# EAGLE design untitled (EAGLE 8.2.1)
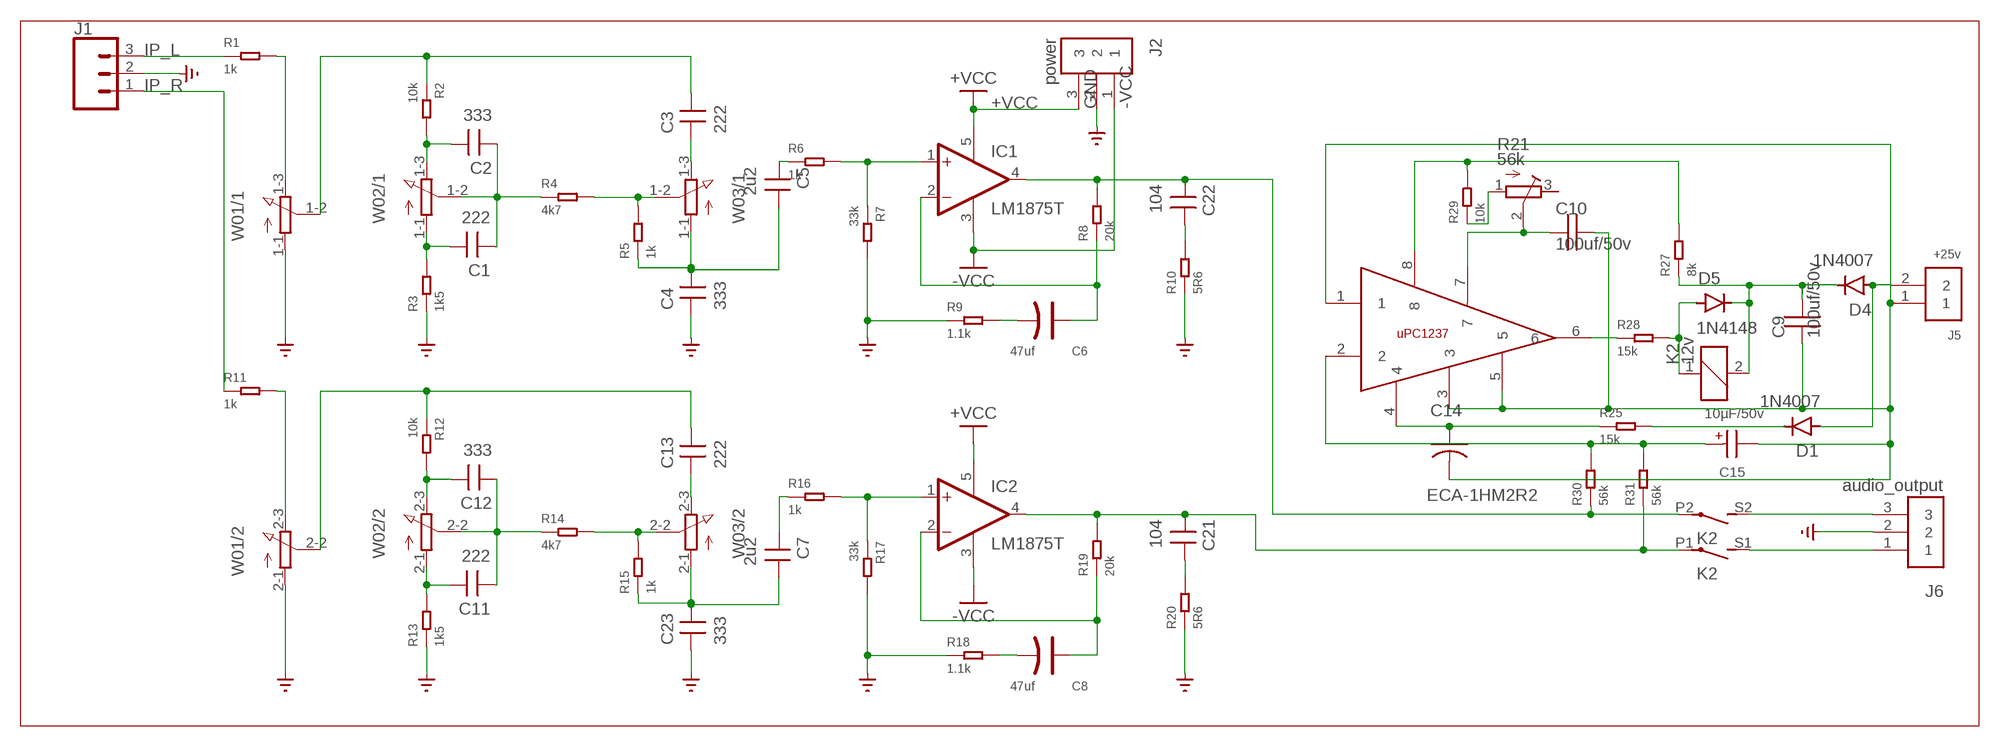
[diagram p0: schematic, sheet 1]

## Parts
C1  222  5.08MM-  [5.08MM-独石电容]
C2  333  5.08MM-  [5.08MM-独石电容]
C3  222  5.08MM-  [5.08MM-独石电容]
C4  333  5.08MM-  [5.08MM-独石电容]
C5  2u2  5.08MM-  [5.08MM-独石电容]
C6  47uf  DIP-ALUMINUM-47UF-16V(D5-H7MM)  [PC-D5.3MM]
C7  2u2  5.08MM-  [5.08MM-独石电容]
C8  47uf  DIP-ALUMINUM-47UF-16V(D5-H7MM)  [PC-D5.3MM]
C9  100uf/50v  50V100UF8X12  [8X12]
C10  100uf/50v  50V100UF8X12  [8X12]
C11  222  5.08MM-  [5.08MM-独石电容]
C12  333  5.08MM-  [5.08MM-独石电容]
C13  222  5.08MM-  [5.08MM-独石电容]
C14  ECA-1HM2R2  [CAP_RADIAL_2MM]
C15  10µF/50v  WCAP-AT1H_5X11_860240272001  [WCAP-AT1H_5X11(DXL)]
C21  104  5.08MM-  [5.08MM-独石电容]
C22  104  5.08MM-  [5.08MM-独石电容]
C23  333  5.08MM-  [5.08MM-独石电容]
D1  1N4007  [DO-41]
D4  1N4007  [DO-41]
D5  1N4148  1N4007  [DO-41]
IC1  LM1875T  [CB367]
IC2  LM1875T  [CB367]
J1  CONN_03POLAR  [MOLEX-1X3]
J2  power  691311400103  [TERMINALBLOCK_PLUGGABLE-3-7.62MM]
J5  +25v  61300211121  [61300211121]
J6  audio_output  691311400103  [TERMINALBLOCK_PLUGGABLE-3-7.62MM]
K2  12v  G2R2A  [G2R2A]
R1  1k  DIP-RES-1M-5%-1/4W(PR-D2.3XL6.5MM)  [PR-D2.3XL6.5MM]
R2  10k  DIP-RES-1M-5%-1/4W(PR-D2.3XL6.5MM)  [PR-D2.3XL6.5MM]
R3  1k5  DIP-RES-1M-5%-1/4W(PR-D2.3XL6.5MM)  [PR-D2.3XL6.5MM]
R4  4k7  DIP-RES-1M-5%-1/4W(PR-D2.3XL6.5MM)  [PR-D2.3XL6.5MM]
R5  1k  DIP-RES-1M-5%-1/4W(PR-D2.3XL6.5MM)  [PR-D2.3XL6.5MM]
R6  1k  DIP-RES-1M-5%-1/4W(PR-D2.3XL6.5MM)  [PR-D2.3XL6.5MM]
R7  33k  DIP-RES-1M-5%-1/4W(PR-D2.3XL6.5MM)  [PR-D2.3XL6.5MM]
R8  20k  DIP-RES-1M-5%-1/4W(PR-D2.3XL6.5MM)  [PR-D2.3XL6.5MM]
R9  1.1k  DIP-RES-1M-5%-1/4W(PR-D2.3XL6.5MM)  [PR-D2.3XL6.5MM]
R10  5R6  DIP-RES-1M-5%-1/4W(PR-D2.3XL6.5MM)  [PR-D2.3XL6.5MM]
R11  1k  DIP-RES-1M-5%-1/4W(PR-D2.3XL6.5MM)  [PR-D2.3XL6.5MM]
R12  10k  DIP-RES-1M-5%-1/4W(PR-D2.3XL6.5MM)  [PR-D2.3XL6.5MM]
R13  1k5  DIP-RES-1M-5%-1/4W(PR-D2.3XL6.5MM)  [PR-D2.3XL6.5MM]
R14  4k7  DIP-RES-1M-5%-1/4W(PR-D2.3XL6.5MM)  [PR-D2.3XL6.5MM]
R15  1k  DIP-RES-1M-5%-1/4W(PR-D2.3XL6.5MM)  [PR-D2.3XL6.5MM]
R16  1k  DIP-RES-1M-5%-1/4W(PR-D2.3XL6.5MM)  [PR-D2.3XL6.5MM]
R17  33k  DIP-RES-1M-5%-1/4W(PR-D2.3XL6.5MM)  [PR-D2.3XL6.5MM]
R18  1.1k  DIP-RES-1M-5%-1/4W(PR-D2.3XL6.5MM)  [PR-D2.3XL6.5MM]
R19  20k  DIP-RES-1M-5%-1/4W(PR-D2.3XL6.5MM)  [PR-D2.3XL6.5MM]
R20  5R6  DIP-RES-1M-5%-1/4W(PR-D2.3XL6.5MM)  [PR-D2.3XL6.5MM]
R21  56k  R-TRIMM3296W  [RTRIM3296W]
R25  15k  DIP-RES-1M-5%-1/4W(PR-D2.3XL6.5MM)  [PR-D2.3XL6.5MM]
R27  8k  DIP-RES-1M-5%-1/4W(PR-D2.3XL6.5MM)  [PR-D2.3XL6.5MM]
R28  15k  DIP-RES-1M-5%-1/4W(PR-D2.3XL6.5MM)  [PR-D2.3XL6.5MM]
R29  10k  DIP-RES-1M-5%-1/4W(PR-D2.3XL6.5MM)  [PR-D2.3XL6.5MM]
R30  56k  DIP-RES-1M-5%-1/4W(PR-D2.3XL6.5MM)  [PR-D2.3XL6.5MM]
R31  56k  DIP-RES-1M-5%-1/4W(PR-D2.3XL6.5MM)  [PR-D2.3XL6.5MM]
U2  UPC1237HA  [SIP8]
W01  3RP/1610G  [3RP/1610G]
W02  3RP/1610G  [3RP/1610G]
W03  3RP/1610G  [3RP/1610G]

## Nets
+VCC: IC1.5(V+) IC2.5(V+) J2.3
-VCC: IC1.3(V-) IC2.3(V-) J2.1
GND: C4.P$2 C23.P$2 J1.2 J2.2 J6.2 R3.1 R7.2 R9.1 R10.1 R13.1 R17.2 R18.1 R20.1 W01.1-1(/1:A) W01.2-1(/2:A) ; supply symbol labelled SUPPLY0_GND_
IP_L: J1.3 R1.1
IP_R: J1.1 R11.1
N$1: R1.2 W01.1-3(/1:E)
N$2: C3.P$1 R2.1 W01.1-2(/1:S)
N$3: C2.P$1 R2.2 W02.1-3(/1:E)
N$4: C1.P$1 R3.2 W02.1-1(/1:A)
N$5: R4.2 R5.2 W03.1-2(/1:S)
N$6: C1.P$2 C2.P$2 R4.1 W02.1-2(/1:S)
N$7: IC1.1(+IN) R6.2 R7.1
N$8: C4.P$1 C5.P$1 R5.1 W03.1-1(/1:A)
N$9: C22.P$2 IC1.4(OUT) K2.P2(3:P) R8.2 R30.1
N$10: C6.+ IC1.2(-IN) R8.1
N$11: C5.P$2 R6.1
N$12: C6.- R9.2
N$13: C22.P$1 R10.2
N$14: C3.P$2 W03.1-3(/1:E)
N$15: R11.2 W01.2-3(/2:E)
N$16: C13.P$1 R12.1 W01.2-2(/2:S)
N$17: C12.P$1 R12.2 W02.2-3(/2:E)
N$18: C11.P$1 R13.2 W02.2-1(/2:A)
N$19: R14.2 R15.2 W03.2-2(/2:S)
N$20: C11.P$2 C12.P$2 R14.1 W02.2-2(/2:S)
N$21: C7.P$1 C23.P$1 R15.1 W03.2-1(/2:A)
N$22: IC2.1(+IN) R16.2 R17.1
N$23: C21.P$2 IC2.4(OUT) K2.P1(2:P) R19.2 R31.1
N$24: C8.+ IC2.2(-IN) R19.1
N$25: C7.P$2 R16.1
N$26: C8.- R18.2
N$27: C21.P$1 R20.2
N$28: C13.P$2 W03.2-3(/2:E)
N$29: J6.1 K2.S1(2:S)
N$30: J6.3 K2.S2(3:S)
N$31: D1.C R25.2
N$32: R21.1(A) R29.1
N$40: D1.A D4.A J5.2
N$41: R28.1 U2.6
N$42: D5.A K2.1 R28.2
N$43: C9.2 D4.C D5.C K2.2 R27.1
N$44: R27.2 R29.2 U2.8
N$45: C10.1 R21.2(S) U2.7
N$46: C9.1 C10.2 C14.2 C15.2(-) J5.1 U2.1 U2.3 U2.5
N$47: C14.1 R25.1 U2.4
N$48: C15.1(+) R30.2 R31.2 U2.2
Unconnected: R21.3(E)

## Library data of the parts
C1-C5 C7 C11-C13 C21-C23 = Audio-Power-amlifier:5.08MM-; LONG: 5.08mm
C6 C8 = OPL_Capacitor:DIP-ALUMINUM-47UF-16V(D5-H7MM): 302030033; MPN: KS 100uF/16V; VALUE: 100uf
C9 C10 = Audio-Power-amlifier:50V100UF8X12
C14 = Resistor_Capacitor:ECA-1HM2R2: CAP ALUM 2.2UF 20% 50V RADIAL Manufacturer's datasheet <https://media.digikey.com/pdf/Data%20Sheets/Panasonic%20Electronic%20Components/ECA-xxM%20Series,TypeA.pdf>; CREATED_BY: PCBLayout.com; DIGIKEY_PART_NUMBER: P5175-ND; MANUFACTURER: Panasonic Electronic Components; MPN: ECA-1HM2R2; PACKAGE: CAP RADIAL 2MM LS
C15 = Wurth_Capacitors_WCAP-AT1H:WCAP-AT1H_5X11: WCAP-AT1H Aluminium Electrolytic Capacitors Long Life +105 °C Characteristics Long life product series Mounting style: THT Radial Capacitance range: 6.8 µF ‒ 3300 µF Capacitance tolerance: ±20 % Voltage range (UR): 10 ‒ 450 V(DC) Operating temperature: -40 °C up to +105 °C for UR ≤100 V(DC) -25 °C up to +105 °C for UR > 100 V(DC) Endurance: 5000 ‒ 10000 h @ +105 °C Dimensions (DxL) in mm: 5.0 x 11.0 up to 18.0 x 35.5 Recommended soldering: Wave soldering Applications Long life applications (industry, medical) Filtering Smoothing Energy storage Coupling e.g. Switched-mode power supply, AC/DC converter, adapter, charger, digital camera <https://www.we-online.com/catalog/media/o14727v209%20Family_WCAP-AT1H.jpg> Details see: https://www.we-online.com/catalog/en/WCAP-AT1H/ Updated by yingchun,Shan;2020-02-28 2020(C) Würth Elektronik; DATASHEET-URL: https://www.we-online.com/catalog/datasheet/860240272001.pdf; DF: 19%; DIAMETER: 5mm; I-LEAK: 4.7uA; I-RIPPLE: 100mA; L: 11mm; OPERATING-TEMPERATURE: -40 °C up to +105 °C; PART-NUMBER: 860240272001; PITCH: 2mm; TECHNICAL-REFERENCE: ATDC110470M010DSPA3E000; VALUE: 47 µF; VR: 10V(DC)
D1 D4 D5 = Diodes:1N4007: DIODE GEN PURP 1KV 1A DO41 Manufacturer's datasheet <https://www.mccsemi.com/pdf/Products/1N4001-1N4007(DO-41).pdf>; CREATED_BY: PCBLayout.com; DIGIKEY_PART_NUMBER: 1N4007MSCT-ND; MANUFACTURER: Micro Commercial Co; MPN: 1N4007; PACKAGE: DO-41
IC1 IC2 = linear:LM1875T: Power OP AMP
J1 = SparkFun-Connectors:CONN_03: Multi connection point. Often used as Generic Header-pin footprint for 0.1 inch spaced/style header connections On any of the 0.1 inch spaced packages, you can populate with these: Break Away Headers - Straight <https://www.sparkfun.com/products/116> (PRT-00116) Break Away Male Headers - Right Angle <https://www.sparkfun.com/products/553> (PRT-00553) Female Headers <https://www.sparkfun.com/products/115> (PRT-00115) Break Away Headers - Machine Pin <https://www.sparkfun.com/products/117> (PRT-00117) Break Away Female Headers - Swiss Machine Pin <https://www.sparkfun.com/products/743> (PRT-00743) Stackable Header - 3 Pin (Female, 0.1") <https://www.sparkfun.com/products/13875> (PRT-13875) For SCREWTERMINALS and SPRING TERMINALS visit here: Screw Terimnals on SparkFun.com <https://www.sparkfun.com/search/results?term=Screw+Terminals> (5mm/3.5mm/2.54mm spacing) This device is also useful as a general connection point to wire up your design to another part of your project. Our various solder wires solder well into these plated through hole pads. Hook-Up Wire - Assortment (Stranded, 22 AWG) <https://www.sparkfun.com/products/11375> (PRT-11375) Hook-Up Wire - Assortment (Solid Core, 22 AWG) <https://www.sparkfun.com/products/11367> (PRT-11367) View the entire wire category on our website here <https://www.sparkfun.com/categories/141> Special notes: Molex polarized connector foot print use with SKU : PRT-08232 with associated crimp pins and housings.; PROD_ID: CONN-08625; SF_ID: PRT-08096
J2 J6 = Terminal Blocks:691311400103: 7.62MM CLOSE VERTICAL PCB HEADER WR-TBL Manufacturer's datasheet <https://katalog.we-online.com/em/datasheet/6913114001xx.pdf>; CREATED_BY: PCBLayout.com; DIGIKEY_PART_NO: 732-2824-ND; MANUFACTURER: WURTH ELEKTRONIK; MPN: 691311400103
J5 = Headers:61300211121: CONN HEADER VERT 2POS 2.54MM Manufacturer's datasheet <https://katalog.we-online.de/em/datasheet/6130xx11121.pdf>; CREATED_BY: PCBLayout.com; DIGI_KEY_PART_NUMBER: 732-5315-ND; MANUFACTURER: Wurth Electronics Inc.; MPN: 61300211121
K2 = relay:G2R2A: RELAY 2 x norm. open, Omron; MPN: G2R-2A-DC24; OC_FARNELL: 6985269; OC_NEWARK: 36M5257
R1-R20 R25 R27-R31 = OPL_Resistor:DIP-RES-1M-5%-1/4W(PR-D2.3XL6.5MM): 301020005; MPN: FHCFR-1/4W-105J; VALUE: 1M
R21 = rcl:R-TRIMM: Trimm resistor; SPICEMODEL: X; SPICEPREFIXL: POT
U2 = Audio-Power-amlifier:UPC1237HA
W01-W03 = pot:3RP/1610G: 16mm Potentiometer two level Source: http://www.alphapotentiometers.net/html/16mm_pot_2.html

## Board
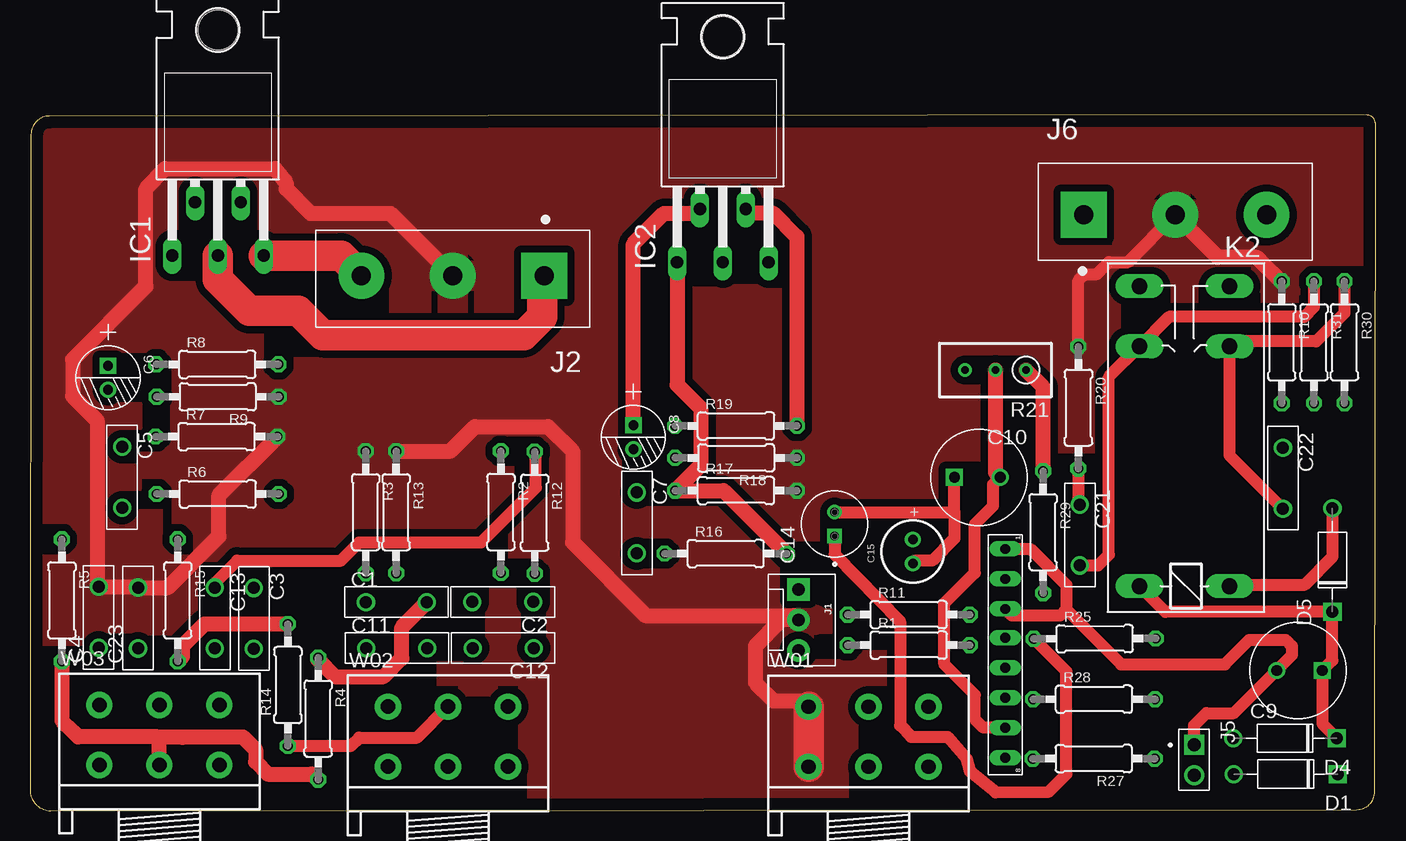
[diagram p1: board, top side]
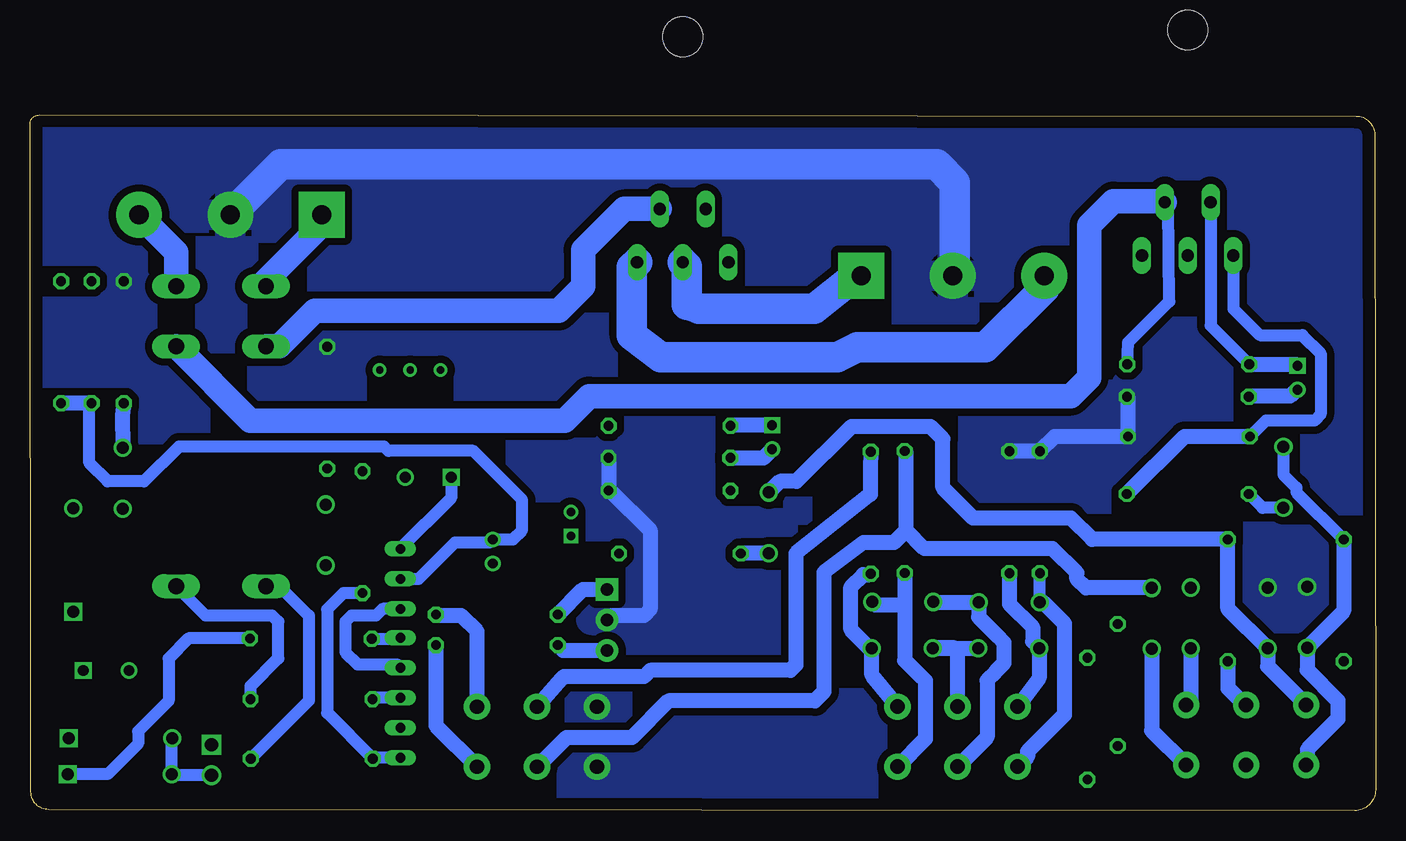
[diagram p2: board, bottom side, seen from below]

Size 112.13 x 57.97 mm. Coordinates in mm from the lower left corner, seen from the top.
Outline: 1.73,0 110.58,0.09 arc90 112.05,1.56 112.13,57.21 arc90 111.36,57.97 1.62,57.88 arc90 0.08,56.34 0,1.74 arc90 1.73,0
Copper layers (1*16): Top 0.035mm / dielectric 1.5mm / Bottom 0.035mm
Design rules "default": minimum track width 6mil, minimum drill 0.35mm, track to track 6mil, track to pad 6mil, pad to pad 6mil, via to via 6mil, smd to smd 6mil, copper to edge 40mil, drill to drill 6mil, minimum pad ring 10mil, minimum via ring 8mil, stop-mask expansion 4mil, vias tented up to drill 0mil, thermal gap 10mil

### Footprints (pad centres in the part's own frame; a part is rotated, then mirrored left to right if it is on the bottom)
5.08MM-独石电容 = drill 1: P$1 -2.54,0; P$2 2.54,0
PC-D5.3MM = drill 0.8 pad 1.35 square: + -1,0 | drill 0.8 pad 1.35: - 1,0
8X12 = drill 0.9: 1 -1.778,0 | drill 0.9 square: 2 2.032,0
CAP_RADIAL_2MM = drill 0.7 pad 1.1 square: 1 -1,0 | drill 0.7 pad 1.1: 2 1,0
WCAP-AT1H_5X11(DXL) = drill 0.8: 1 1,0; 2 -1,0
DO-41 = drill 1: A 4.325,0 | drill 1 square: C -4.325,0
CB367 = drill 1.016 long: 1 -3.81,-11.43; 2 -1.905,-6.985; 3 0,-11.43; 4 1.905,-6.985; 5 3.81,-11.43 | hole 3.302: 0,7.366
MOLEX-1X3 = drill 1.016 pad 1.88 square: 1 0,0 | drill 1.016 pad 1.88: 2 2.54,0; 3 5.08,0
TERMINALBLOCK_PLUGGABLE-3-7.62MM = drill 1.6 pad 3.81 square: 1 -7.62,0 | drill 1.6 pad 3.81: 2 0,0; 3 7.62,0
61300211121 = drill 1.1 square: 1 -1.27,0 | drill 1.1: 2 1.27,0
G2R2A = drill 1.321 long: 1 -2.54,-3.683; 2 -2.54,3.81; P1 17.45,3.81; P2 17.45,-3.683; S1 22.454,3.81; S2 22.454,-3.683
PR-D2.3XL6.5MM = drill 0.813 octagon: 1 -4.953,0; 2 5.207,0
RTRIM3296W = drill 0.61: 1 0,-2.54; 2 0,0; 3 0,2.54
SIP8 = drill 0.8 long: 1 -8.8,3.6; 2 -6.3,3.6; 3 -3.8,3.6; 4 -1.4,3.6; 5 1.1,3.6; 6 3.6,3.6; 7 6.1,3.6; 8 8.6,3.6
3RP/1610G = drill 1.2 pad 2.184: 1-1 -5,0; 1-2 0,0; 1-3 5,0; 2-1 -5,5; 2-2 0,5; 2-3 5,5

### Placement (x,y rotation side)
C1  30.54,17.37 0 top
C2  39.4,17.39 180 top
C3  18.65,16.02 270 top
C4  5.71,16.11 90 top
C5  7.67,27.78 270 top
C6  6.5,36.07 270 top
C7  50.56,23.98 270 top
C8  50.28,31.12 270 top
C9  105.66,11.69 0 top
C10  79.07,27.78 180 top
C11  30.57,13.55 0 top
C12  39.43,13.55 180 top
C13  15.4,16.06 270 top
C14  67.05,23.88 90 top
C15  73.57,21.6 90 top
C21  87.48,22.97 270 top
C22  104.42,27.71 270 top
C23  9,16.06 90 top
D1  104.65,3.05 180 top
D4  104.59,6.03 180 top
D5  108.54,20.89 90 top
IC1  15.66,57.69 0 top
IC2  57.73,57.13 0 top
J1  64.05,18.43 270 top
J2  35.23,44.58 180 top
J5  97.01,4.23 270 top
J6  95.43,49.65 0 top
K2  96.27,21.25 90 top
R1  73.1,13.8 0 top
R2  39.24,25.02 270 top
R3  27.97,25 270 top
R4  24.01,7.8 270 top
R5  2.66,17.65 270 top
R6  15.52,26.39 0 top
R7  15.42,31.18 0 top
R8  15.48,37.19 0 top
R9  15.77,34.49 180 top
R10  104.31,39.16 270 top
R11  73.1,16.34 0 top
R12  42.06,24.96 270 top
R13  30.51,25 270 top
R14  21.49,10.34 90 top
R15  12.31,17.65 270 top
R16  57.84,21.43 0 top
R17  58.71,26.68 0 top
R18  58.97,29.4 180 top
R19  58.71,32.07 0 top
R20  87.37,33.72 270 top
R21  80.45,36.72 90 top
R25  88.6,14.33 0.2 top
R27  88.77,4.34 180 top
R28  88.55,9.29 0 top
R29  84.42,23.34 270 top
R30  109.54,39.16 270 top
R31  107,39.16 270 top
U2  77.67,13.01 270 top
W01  69.88,3.66 0 top
W02  34.83,3.67 0 top
W03  10.78,3.81 0 top

### Tracks (layer width: path | path; a pad name or v marks a point on that pad's centre or on a via)
+VCC
  Top 2.54: IC1.5 25.93,46.26 J2.3
  Bottom 2.54: J2.3 27.61,43.5 32.51,38.61 43.18,38.61 44.85,37.78 59.58,37.78 61.97,39.63 61.97,45.27 IC2.5
-VCC
  Top 2.54: IC1.3 15.66,44.28 18.29,41.66 22.35,41.66 24.38,39.63 41.15,39.63 42.67,41.15 42.67,44.4 J2.1
  Bottom 2.54: J2.1 43.3,44.58 46.76,41.83 56.41,41.83 57.4,42.17 57.4,45.37 IC2.3
GND
  Top 1.016: R20.1 87.37,44.19 87.88,44.71 88.9,44.71 89.91,45.72 91.5,45.72 J6.2
  Top 1.27: W01.2-1 64.39,9.15 61.97,9.15 60.45,10.67 60.45,13.72 62.62,15.89 J1.2 63.68,16.26 51.31,16.26 45.21,22.35 45.21,29.97 43.18,32.01 37.08,32.01 35.03,29.96 R13.1 | J2.2 30.03,49.79 23.37,49.79 21.33,51.82 21.33,52.33 20.4,53.5 11.25,53.5 9.65,51.82 9.65,43.69 3.55,37.59 3.55,34.55 5.59,32.51 5.59,18.78 C4.P$2 8.94,18.65 C23.P$2 11.48,18.6 15.75,22.86 15.75,26.29 R7.2 | R10.1 104.22,44.11 102.61,45.72 102.61,45.73 102.23,46.11 98.97,46.11 J6.2
  Top 2.54: W01.2-1 W01.1-1
  Bottom 1.27: R18.1 63.91,29.39 R17.2 63.76,26.68 60.45,23.37 60.45,16.77 60.96,16.26 63.68,16.26 J1.2 | R9.1 20.63,34.4 R7.2 26.75,31.18 R3.1 R13.1
  Bottom 2.54: J2.2 35.05,44.77 35.05,52.33 36.57,53.85 91.23,53.85 J6.2
  pour Top (isolate 0.61): 1.01,57.91 0,55.37 0,1.02 1.01,0 111.11,0.12 112.12,1.14 112.12,55.49 111.11,58.03
  pour Bottom (isolate 0.61): 111.11,58.03 3.75,57.92 arc68 0,55.37 0,1.02 1.01,0 111.11,0.12 112.12,1.14 112.12,55.49
IP_L
  Bottom 1.27: R1.1 67.7,13.35 J1.3
IP_R
  Bottom 1.27: R11.1 66.05,18.43 J1.1
N$1
  Bottom 1.27: R1.2 78.3,7.09 W01.1-3
N$2
  Bottom 1.27: C3.P$1 24.14,18.56 24.89,19.31 24.89,19.81 26.92,21.85 37.59,21.85 39.11,23.37 | R2.1 39.11,29.84 39.11,23.37 | 39.11,23.37 40.13,22.35 42.67,22.35 45.97,19.87 45.97,9.91 46.73,9.15 58.93,9.15 61.97,6.1 67.44,6.1 W01.1-2
N$3
  Bottom 1.27: R2.2 39.24,17.13 | 39.24,17.13 39.24,12.52 37.82,11.1 37.77,11.1 37.51,10.84 37.51,5.99 W02.1-3 | 39.24,17.13 41.67,17.13 C2.P$1
N$4
  Bottom 1.016: 27.71,17.37 C1.P$1 28,19.77 R3.2
  Bottom 1.27: 27.71,17.37 25.94,15.6 25.94,7.98 28.99,4.94 28.99,4.51 W02.1-1
N$5
  Top 1.27: R5.2 2.66,7.5 3.55,6.61 3.55,6.6 4.01,6.15 10.67,6.15 | R4.2 23.97,2.54 23.46,3.05 19.81,3.05 18.79,4.07 18.79,5.08 17.73,6.15 12.66,6.15 | 10.67,6.15 12.66,6.15 | 12.66,6.15 12.7,6.11 | W03.1-2 10.78,6.03 10.67,6.15
N$6
  Top 1.27: R4.1 24.01,12.56 25.4,11.18 29.46,11.18 30.99,12.7 30.99,15.28 C1.P$2
  Bottom 1.27: C2.P$2 36.84,17.37 C1.P$2 33.08,16.14 31.53,14.59 31.53,14.56 30.98,14.01 30.98,12.29 31.67,11.6 31.67,11.55 32.36,10.86 32.36,6.14 W02.1-2
N$7
  Bottom 1.016: IC1.1 11.85,41.83 9.65,39.63 6.09,39.63 4.57,38.1 4.57,33.02 5.08,32.51 9.14,32.51 R7.1
  Bottom 1.27: R7.1 15.94,31.18 R6.2
N$8
  Bottom 1.016: C5.P$1 7.67,28 6.6,26.93 6.6,26.55 R5.1
  Bottom 1.27: R5.1 2.66,16.63 C4.P$1 5.71,11.74 3.14,9.17 3.14,7.65 5.68,5.11 5.68,3.91 W03.1-1
N$9
  Top 1.016: R30.1 109.54,41.47 107.19,39.12 100.37,39.12 K2.P2 99.95,29.63 C22.P$2
  Bottom 1.016: R8.2 20.61,39.02 17.19,42.44 17.27,50.41 IC1.4
  Bottom 2.032: IC1.4 17.66,50.8 21.84,50.8 23.87,48.77 23.87,36.07 25.4,34.55 65.53,34.55 67.56,32.51 93.77,32.51 K2.P2
N$10
  Bottom 1.016: IC1.2 13.75,40.42 R8.1
  Bottom 1.27: R8.1 6.62,37.19 C6.+
N$11
  Bottom 1.016: C5.P$2 9.41,25.24 R6.1
N$12
  Bottom 1.27: C6.- 6.58,35.07 7.11,34.55 10.51,34.55 R9.2
N$13
  Bottom 1.27: R10.2 104.44,32.97 C22.P$1
N$14
  Bottom 1.27: C3.P$2 18.65,6.68 W03.1-3
N$15
  Bottom 1.27: W01.2-3 74.88,14.94 76.2,16.26 78.22,16.26 R11.2
N$16
  Top 1.016: C13.P$1 15.4,18.96 17.27,20.83 25.91,20.83 27.43,22.35 37.59,22.35 42.16,26.93 42.16,29.81 R12.1
  Bottom 1.27: R12.1 42.09,28.55 42.09,26.35 48.3,21.45 48.3,12.15 48.77,11.69 60.45,11.69 60.96,11.18 67.65,11.18 67.87,10.96 W01.2-2
N$17
  Bottom 1.27: W02.2-3 41.97,11.3 C12.P$1 42.18,13.55 43.72,15.1 43.72,18.65 42.7,19.67 42.15,19.67 R12.2
N$18
  Bottom 1.27: W02.2-1 28.03,11.04 C11.P$1 28.58,14.1 28.58,15.31 30.51,17.24 R13.2
N$19
  Top 1.27: R14.2 14.53,15.55 12.7,13.72 12.7,12.84 R15.2
  Bottom 1.27: W03.2-2 10.91,8.81 12.29,10.19 12.29,12.42 R15.2
N$20
  Top 1.016: R14.1 26.72,5.39 27.43,6.1 32.26,6.1 W02.2-2
  Bottom 1.27: C11.P$2 C12.P$2 36.87,13.57 35.08,13.57 34.83,13.32 W02.2-2
N$21
  Bottom 1.27: W03.2-1 9,12.03 C23.P$1 12.31,16.83 R15.1 23.62,22.61 25.4,24.39 33.53,24.39 36.07,26.93 36.07,30.99 37.08,32.01 43.69,32.01 48.26,27.43 49.65,27.43 C7.P$1 50.46,26.42
N$22
  Top 1.27: IC2.1 53.92,35.48 55.88,33.53 55.88,28.8 R17.1 57.8,26.68 R16.2
N$23
  Top 1.016: C21.P$2 89.01,20.43 89.91,21.34 89.91,36.15 K2.P1 94.91,41.15 106.17,41.15 107,41.98 R31.1
  Top 1.27: R19.2 63.91,47.85 61.97,49.79 60,49.79 IC2.4
  Bottom 2.032: K2.P1 91.35,38.7 88.39,41.66 68.07,41.66 66.04,43.69 66.04,46.74 62.63,50.15 IC2.4
N$24
  Top 1.27: C8.+ 50.28,47.24 52.83,49.79 55.47,49.79 IC2.2
  Bottom 1.27: C8.+ 53.7,32.12 R19.1
N$25
  Bottom 1.27: C7.P$2 R16.1
N$26
  Bottom 1.27: R18.2 51,29.4 C8.-
N$27
  Top 1.016: R20.2 87.37,25.63 C21.P$1
N$28
  Bottom 1.27: C13.P$2 15.4,9.19 W03.2-3
N$29
  Bottom 2.032: J6.1 87.81,48.84 92.96,43.69 92.47,43.69 K2.S1
N$30
  Bottom 2.032: K2.S2 99.95,46.55 J6.3
N$31
  Bottom 1.016: R25.2 98.93,14.35 100.58,12.7 100.58,9.15 103.12,6.61 103.12,5.59 105.66,3.05 D1.C
N$32
  Top 1.27: R29.1 84.42,35.29 R21.1
N$40
  Bottom 1.016: J5.2 100.23,2.96 D1.A 100.32,5.97 D4.A
N$41
  Bottom 1.016: U2.6 83.47,9.41 R28.1
N$42
  Top 1.016: D5.A 108.54,21.17 106.17,18.8 100.04,18.8 K2.1
  Bottom 1.016: R28.2 93.75,10.39 91.44,12.7 91.44,15.75 91.95,16.26 97.5,16.26 K2.1
N$43
  Top 1.016: D4.C 107.69,7.25 C9.2 108.54,12.53 D5.C 94.61,16.56 K2.2
  Bottom 1.016: K2.2 91.35,18.71 88.9,16.26 88.9,9.16 R27.1
N$44
  Bottom 1.016: U2.8 83.49,4.41 R27.2 87.37,8.15 87.37,16.77 86.01,18.13 R29.2
N$45
  Top 1.016: U2.7 79.45,6.91 78.74,7.62 78.74,9.65 76.2,12.19 76.2,17.27 78.74,19.81 78.74,23.88 80.26,25.4 80.26,27.19 C10.1
  Top 1.27: R21.2 80.45,28.17 C10.1
N$46
  Top 1.016: U2.1 83.34,21.81 86.36,18.8 86.36,16.77 | 86.36,16.77 85.85,16.26 81.82,16.26 U2.3 | 86.36,16.77 90.93,12.19 99.57,12.19 101.6,14.23 104.65,14.23 105.15,13.72 105.15,12.96 C9.1 100.33,8.13 98.04,8.13 97.01,7.1 J5.1 | 77.04,24.89 C10.2 | 77.04,24.89 77.04,22.68 75.18,20.83 73.8,20.83 C15.2 | C14.2 77.02,24.88 77.04,24.89
  Bottom 1.016: U2.3 82.75,16.81 83.31,16.26 85.34,16.26 85.85,15.75 85.85,13.21 84.83,12.19 81.55,12.19 U2.5 | C10.2 77.04,26.04 U2.1
N$47
  Top 1.016: C14.1 67.05,21.34 72.5,15.75 72.5,7.11 73.43,6.15 76.48,6.15 78.04,4.37 78.31,3.28 80.48,1.52 84.9,1.59 86.36,3.05 86.36,11.61 R25.1
  Bottom 1.016: R25.1 81.36,14.32 U2.4
N$48
  Bottom 1.016: U2.2 79.75,19.31 76.71,22.35 73.82,22.35 C15.1 71.88,22.6 71.12,23.37 71.12,25.91 75.18,29.97 82.27,29.97 82.64,30.34 99.71,30.34 102.61,27.43 105.66,27.43 107.19,28.96 107.19,33.77 R31.2
  Bottom 1.27: R31.2 R30.2